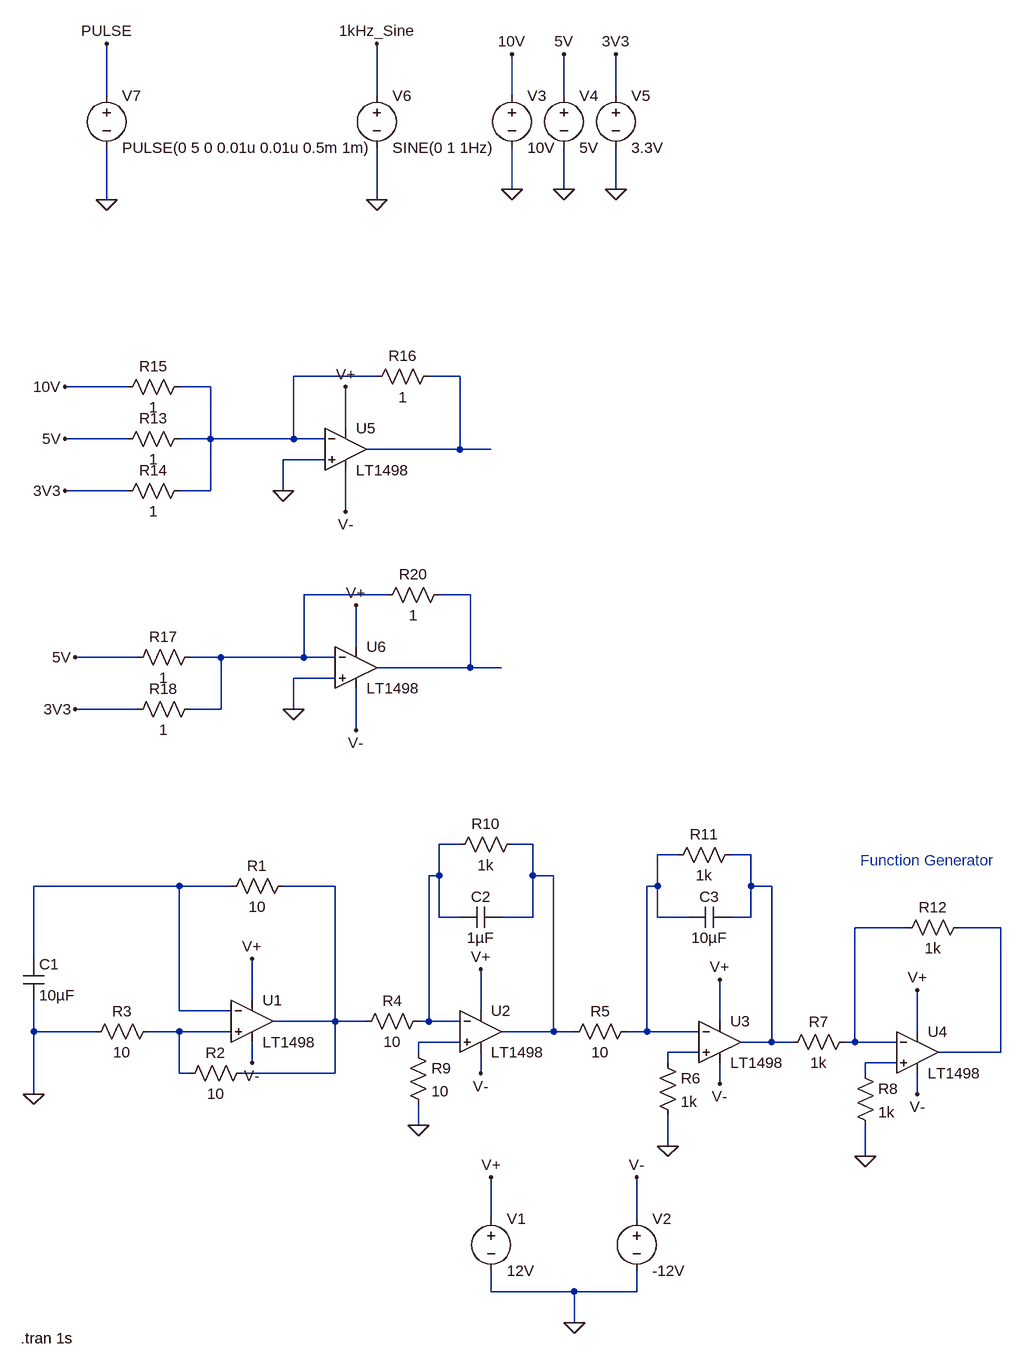
[diagram p0: schematic OpAmp F Generator Amp App .asc]
OpAmp F Generator Amp App .asc, the LTspice schematic file:
Version 4
SHEET 1 1084 680
WIRE -304 -1264 -304 -1344
WIRE 112 -1264 112 -1344
WIRE 320 -1264 320 -1328
WIRE 400 -1264 400 -1328
WIRE 480 -1264 480 -1328
WIRE 320 -1120 320 -1184
WIRE 400 -1120 400 -1184
WIRE 480 -1120 480 -1184
WIRE -304 -1104 -304 -1184
WIRE 112 -1104 112 -1184
WIRE 112 -832 -16 -832
WIRE 240 -832 192 -832
WIRE -272 -816 -368 -816
WIRE -144 -816 -192 -816
WIRE 64 -752 64 -816
WIRE -272 -736 -368 -736
WIRE -144 -736 -144 -816
WIRE -144 -736 -192 -736
WIRE -16 -736 -16 -832
WIRE -16 -736 -144 -736
WIRE 32 -736 -16 -736
WIRE 240 -720 240 -832
WIRE 240 -720 96 -720
WIRE 288 -720 240 -720
WIRE 32 -704 -32 -704
WIRE -272 -656 -368 -656
WIRE -144 -656 -144 -736
WIRE -144 -656 -192 -656
WIRE -32 -656 -32 -704
WIRE 64 -624 64 -688
WIRE 128 -496 0 -496
WIRE 256 -496 208 -496
WIRE 80 -416 80 -480
WIRE -256 -400 -352 -400
WIRE -128 -400 -176 -400
WIRE 0 -400 0 -496
WIRE 0 -400 -128 -400
WIRE 48 -400 0 -400
WIRE 256 -384 256 -496
WIRE 256 -384 112 -384
WIRE 304 -384 256 -384
WIRE 48 -368 -16 -368
WIRE -256 -320 -352 -320
WIRE -128 -320 -128 -400
WIRE -128 -320 -176 -320
WIRE -16 -320 -16 -368
WIRE 80 -288 80 -352
WIRE 240 -112 208 -112
WIRE 352 -112 320 -112
WIRE 576 -96 544 -96
WIRE 688 -96 656 -96
WIRE 208 -64 208 -112
WIRE 208 -64 192 -64
WIRE 352 -64 352 -112
WIRE 384 -64 352 -64
WIRE -192 -48 -416 -48
WIRE -112 -48 -192 -48
WIRE 48 -48 -32 -48
WIRE 544 -48 544 -96
WIRE 544 -48 528 -48
WIRE 688 -48 688 -96
WIRE 720 -48 688 -48
WIRE 208 0 208 -64
WIRE 240 0 208 0
WIRE 352 0 352 -64
WIRE 352 0 304 0
WIRE 544 0 544 -48
WIRE 592 0 544 0
WIRE 688 0 688 -48
WIRE 688 0 656 0
WIRE 928 16 848 16
WIRE 1072 16 1008 16
WIRE -416 64 -416 -48
WIRE -80 128 -80 64
WIRE -192 144 -192 -48
WIRE -112 144 -192 144
WIRE 272 144 272 80
WIRE 48 160 48 -48
WIRE 48 160 -48 160
WIRE 96 160 48 160
WIRE 192 160 192 -64
WIRE 192 160 176 160
WIRE 240 160 192 160
WIRE 640 160 640 96
WIRE -416 176 -416 128
WIRE -320 176 -416 176
WIRE -192 176 -240 176
WIRE -112 176 -192 176
WIRE 384 176 384 -64
WIRE 384 176 304 176
WIRE 416 176 384 176
WIRE 528 176 528 -48
WIRE 528 176 496 176
WIRE 608 176 528 176
WIRE 944 176 944 112
WIRE 240 192 176 192
WIRE 720 192 720 -48
WIRE 720 192 672 192
WIRE 752 192 720 192
WIRE 848 192 848 16
WIRE 848 192 832 192
WIRE 912 192 848 192
WIRE 176 208 176 192
WIRE 608 208 560 208
WIRE 1072 208 1072 16
WIRE 1072 208 976 208
WIRE -80 224 -80 192
WIRE 560 224 560 208
WIRE 912 224 864 224
WIRE -192 240 -192 176
WIRE -176 240 -192 240
WIRE 48 240 48 160
WIRE 48 240 -96 240
WIRE 272 240 272 208
WIRE 864 240 864 224
WIRE 640 256 640 224
WIRE -416 272 -416 176
WIRE 944 272 944 240
WIRE 176 320 176 288
WIRE 560 352 560 304
WIRE 864 368 864 320
WIRE 288 464 288 400
WIRE 512 464 512 400
WIRE 288 576 288 544
WIRE 416 576 288 576
WIRE 512 576 512 544
WIRE 512 576 416 576
WIRE 416 624 416 576
FLAG 288 400 V+
FLAG 512 400 V-
FLAG 416 624 0
FLAG -416 272 0
FLAG 560 352 0
FLAG 864 368 0
FLAG 176 320 0
FLAG -32 -656 0
FLAG 320 -1120 0
FLAG 400 -1120 0
FLAG 480 -1120 0
FLAG 480 -1328 3V3
FLAG 400 -1328 5V
FLAG 320 -1328 10V
FLAG 112 -1104 0
FLAG 112 -1344 1kHz_Sine
FLAG -304 -1104 0
FLAG -304 -1344 PULSE
FLAG -368 -816 10V
FLAG -368 -736 5V
FLAG -368 -656 3V3
FLAG -80 64 V+
FLAG 272 80 V+
FLAG 640 96 V+
FLAG 944 112 V+
FLAG -80 224 V-
FLAG 272 240 V-
FLAG 640 256 V-
FLAG 944 272 V-
FLAG 64 -816 V+
FLAG 64 -624 V-
FLAG -16 -320 0
FLAG -352 -400 5V
FLAG -352 -320 3V3
FLAG 80 -480 V+
FLAG 80 -288 V-
SYMBOL OpAmps\\LT1498 -80 96 R0
SYMATTR InstName U1
SYMBOL OpAmps\\LT1498 272 112 R0
SYMATTR InstName U2
SYMBOL OpAmps\\LT1498 640 128 R0
SYMATTR InstName U3
SYMBOL OpAmps\\LT1498 944 144 R0
SYMATTR InstName U4
SYMBOL voltage 288 448 R0
SYMATTR InstName V1
SYMATTR Value 12V
SYMBOL voltage 512 448 R0
SYMATTR InstName V2
SYMATTR Value -12V
SYMBOL res -16 -64 R90
WINDOW 0 0 56 VBottom 2
WINDOW 3 32 56 VTop 2
SYMATTR InstName R1
SYMATTR Value 10
SYMBOL res -80 224 R90
WINDOW 0 0 56 VBottom 2
WINDOW 3 32 56 VTop 2
SYMATTR InstName R2
SYMATTR Value 10
SYMBOL res -224 160 R90
WINDOW 0 0 56 VBottom 2
WINDOW 3 32 56 VTop 2
SYMATTR InstName R3
SYMATTR Value 10
SYMBOL cap -432 64 R0
SYMATTR InstName C1
SYMATTR Value 10µF
SYMBOL res 192 144 R90
WINDOW 0 0 56 VBottom 2
WINDOW 3 32 56 VTop 2
SYMATTR InstName R4
SYMATTR Value 10
SYMBOL res 512 160 R90
WINDOW 0 0 56 VBottom 2
WINDOW 3 32 56 VTop 2
SYMATTR InstName R5
SYMATTR Value 10
SYMBOL res 544 208 R0
SYMATTR InstName R6
SYMATTR Value 1k
SYMBOL res 848 176 R90
WINDOW 0 0 56 VBottom 2
WINDOW 3 32 56 VTop 2
SYMATTR InstName R7
SYMATTR Value 1k
SYMBOL res 848 224 R0
SYMATTR InstName R8
SYMATTR Value 1k
SYMBOL res 160 192 R0
SYMATTR InstName R9
SYMATTR Value 10
SYMBOL cap 304 -16 R90
WINDOW 0 0 32 VBottom 2
WINDOW 3 32 32 VTop 2
SYMATTR InstName C2
SYMATTR Value 1µF
SYMBOL res 336 -128 R90
WINDOW 0 0 56 VBottom 2
WINDOW 3 32 56 VTop 2
SYMATTR InstName R10
SYMATTR Value 1k
SYMBOL cap 656 -16 R90
WINDOW 0 0 32 VBottom 2
WINDOW 3 32 32 VTop 2
SYMATTR InstName C3
SYMATTR Value 10µF
SYMBOL res 672 -112 R90
WINDOW 0 0 56 VBottom 2
WINDOW 3 32 56 VTop 2
SYMATTR InstName R11
SYMATTR Value 1k
SYMBOL res 1024 0 R90
WINDOW 0 0 56 VBottom 2
WINDOW 3 32 56 VTop 2
SYMATTR InstName R12
SYMATTR Value 1k
SYMBOL OpAmps\\LT1498 64 -784 R0
SYMATTR InstName U5
SYMBOL res -176 -752 R90
WINDOW 0 0 56 VBottom 2
WINDOW 3 32 56 VTop 2
SYMATTR InstName R13
SYMATTR Value 1
SYMBOL res -176 -672 R90
WINDOW 0 0 56 VBottom 2
WINDOW 3 32 56 VTop 2
SYMATTR InstName R14
SYMATTR Value 1
SYMBOL res -176 -832 R90
WINDOW 0 0 56 VBottom 2
WINDOW 3 32 56 VTop 2
SYMATTR InstName R15
SYMATTR Value 1
SYMBOL voltage 320 -1280 R0
SYMATTR InstName V3
SYMATTR Value 10V
SYMBOL voltage 400 -1280 R0
SYMATTR InstName V4
SYMATTR Value 5V
SYMBOL voltage 480 -1280 R0
SYMATTR InstName V5
SYMATTR Value 3.3V
SYMBOL voltage 112 -1280 R0
WINDOW 123 0 0 Left 0
WINDOW 39 0 0 Left 0
SYMATTR InstName V6
SYMATTR Value SINE(0 1 1Hz)
SYMBOL voltage -304 -1280 R0
WINDOW 123 0 0 Left 0
WINDOW 39 0 0 Left 0
SYMATTR InstName V7
SYMATTR Value PULSE(0 5 0 0.01u 0.01u 0.5m 1m)
SYMBOL res 208 -848 R90
WINDOW 0 0 56 VBottom 2
WINDOW 3 32 56 VTop 2
SYMATTR InstName R16
SYMATTR Value 1
SYMBOL OpAmps\\LT1498 80 -448 R0
SYMATTR InstName U6
SYMBOL res -160 -416 R90
WINDOW 0 0 56 VBottom 2
WINDOW 3 32 56 VTop 2
SYMATTR InstName R17
SYMATTR Value 1
SYMBOL res -160 -336 R90
WINDOW 0 0 56 VBottom 2
WINDOW 3 32 56 VTop 2
SYMATTR InstName R18
SYMATTR Value 1
SYMBOL res 224 -512 R90
WINDOW 0 0 56 VBottom 2
WINDOW 3 32 56 VTop 2
SYMATTR InstName R20
SYMATTR Value 1
TEXT 856 -88 Left 2 ;Function Generator
TEXT -436 648 Left 2 !.tran 1s

The netlist it stands for:
* OpAmp F Generator Amp App .asc
XU1 N013 N009 V+ V- N010 LT1498  ; pins In+ In- V+ V- OUT
XU2 N014 N005 V+ V- N006 LT1498  ; pins In+ In- V+ V- OUT
XU3 N015 N007 V+ V- N008 LT1498  ; pins In+ In- V+ V- OUT
XU4 N016 N011 V+ V- N012 LT1498  ; pins In+ In- V+ V- OUT
V1 V+ 0 12V
V2 V- 0 -12V
R1 N010 N009 10
R2 N010 N013 10
R3 N013 0 10
C1 N009 0 10µF
R4 N005 N010 10
R5 N007 N006 10
R6 N015 0 1k
R7 N011 N008 1k
R8 N016 0 1k
R9 N014 0 10
C2 N006 N005 1µF
R10 N006 N005 1k
C3 N008 N007 10µF
R11 N008 N007 1k
R12 N012 N011 1k
XU5 0 N001 V+ V- N002 LT1498  ; pins In+ In- V+ V- OUT
R13 N001 5V 1
R14 N001 3V3 1
R15 N001 10V 1
V3 10V 0 10V
V4 5V 0 5V
V5 3V3 0 3.3V
V6 1kHz_Sine 0 SINE(0 1 1Hz)
V7 PULSE 0 PULSE(0 5 0 0.01u 0.01u 0.5m 1m)
R16 N002 N001 1
XU6 0 N003 V+ V- N004 LT1498  ; pins In+ In- V+ V- OUT
R17 N003 5V 1
R18 N003 3V3 1
R20 N004 N003 1
* Function Generator
.tran 1s
.lib LTC.lib
.backanno
.end